# Altium schematic sheet Mother_board.SchDoc
size 594 x 420 mm; CheckedBy: Алексеев; Author: Нгуен; CompanyName: ПИСК, гр.912601; DrawnBy: Алексеев; Engineer: Алексеев; Address3: Т; Address4: коротковолновой радиостанций; DocumentNumber: ГУИР.467872.014-001 Э3; SheetNumber: 1; SheetTotal: 1; ImagePath: Евдокимова
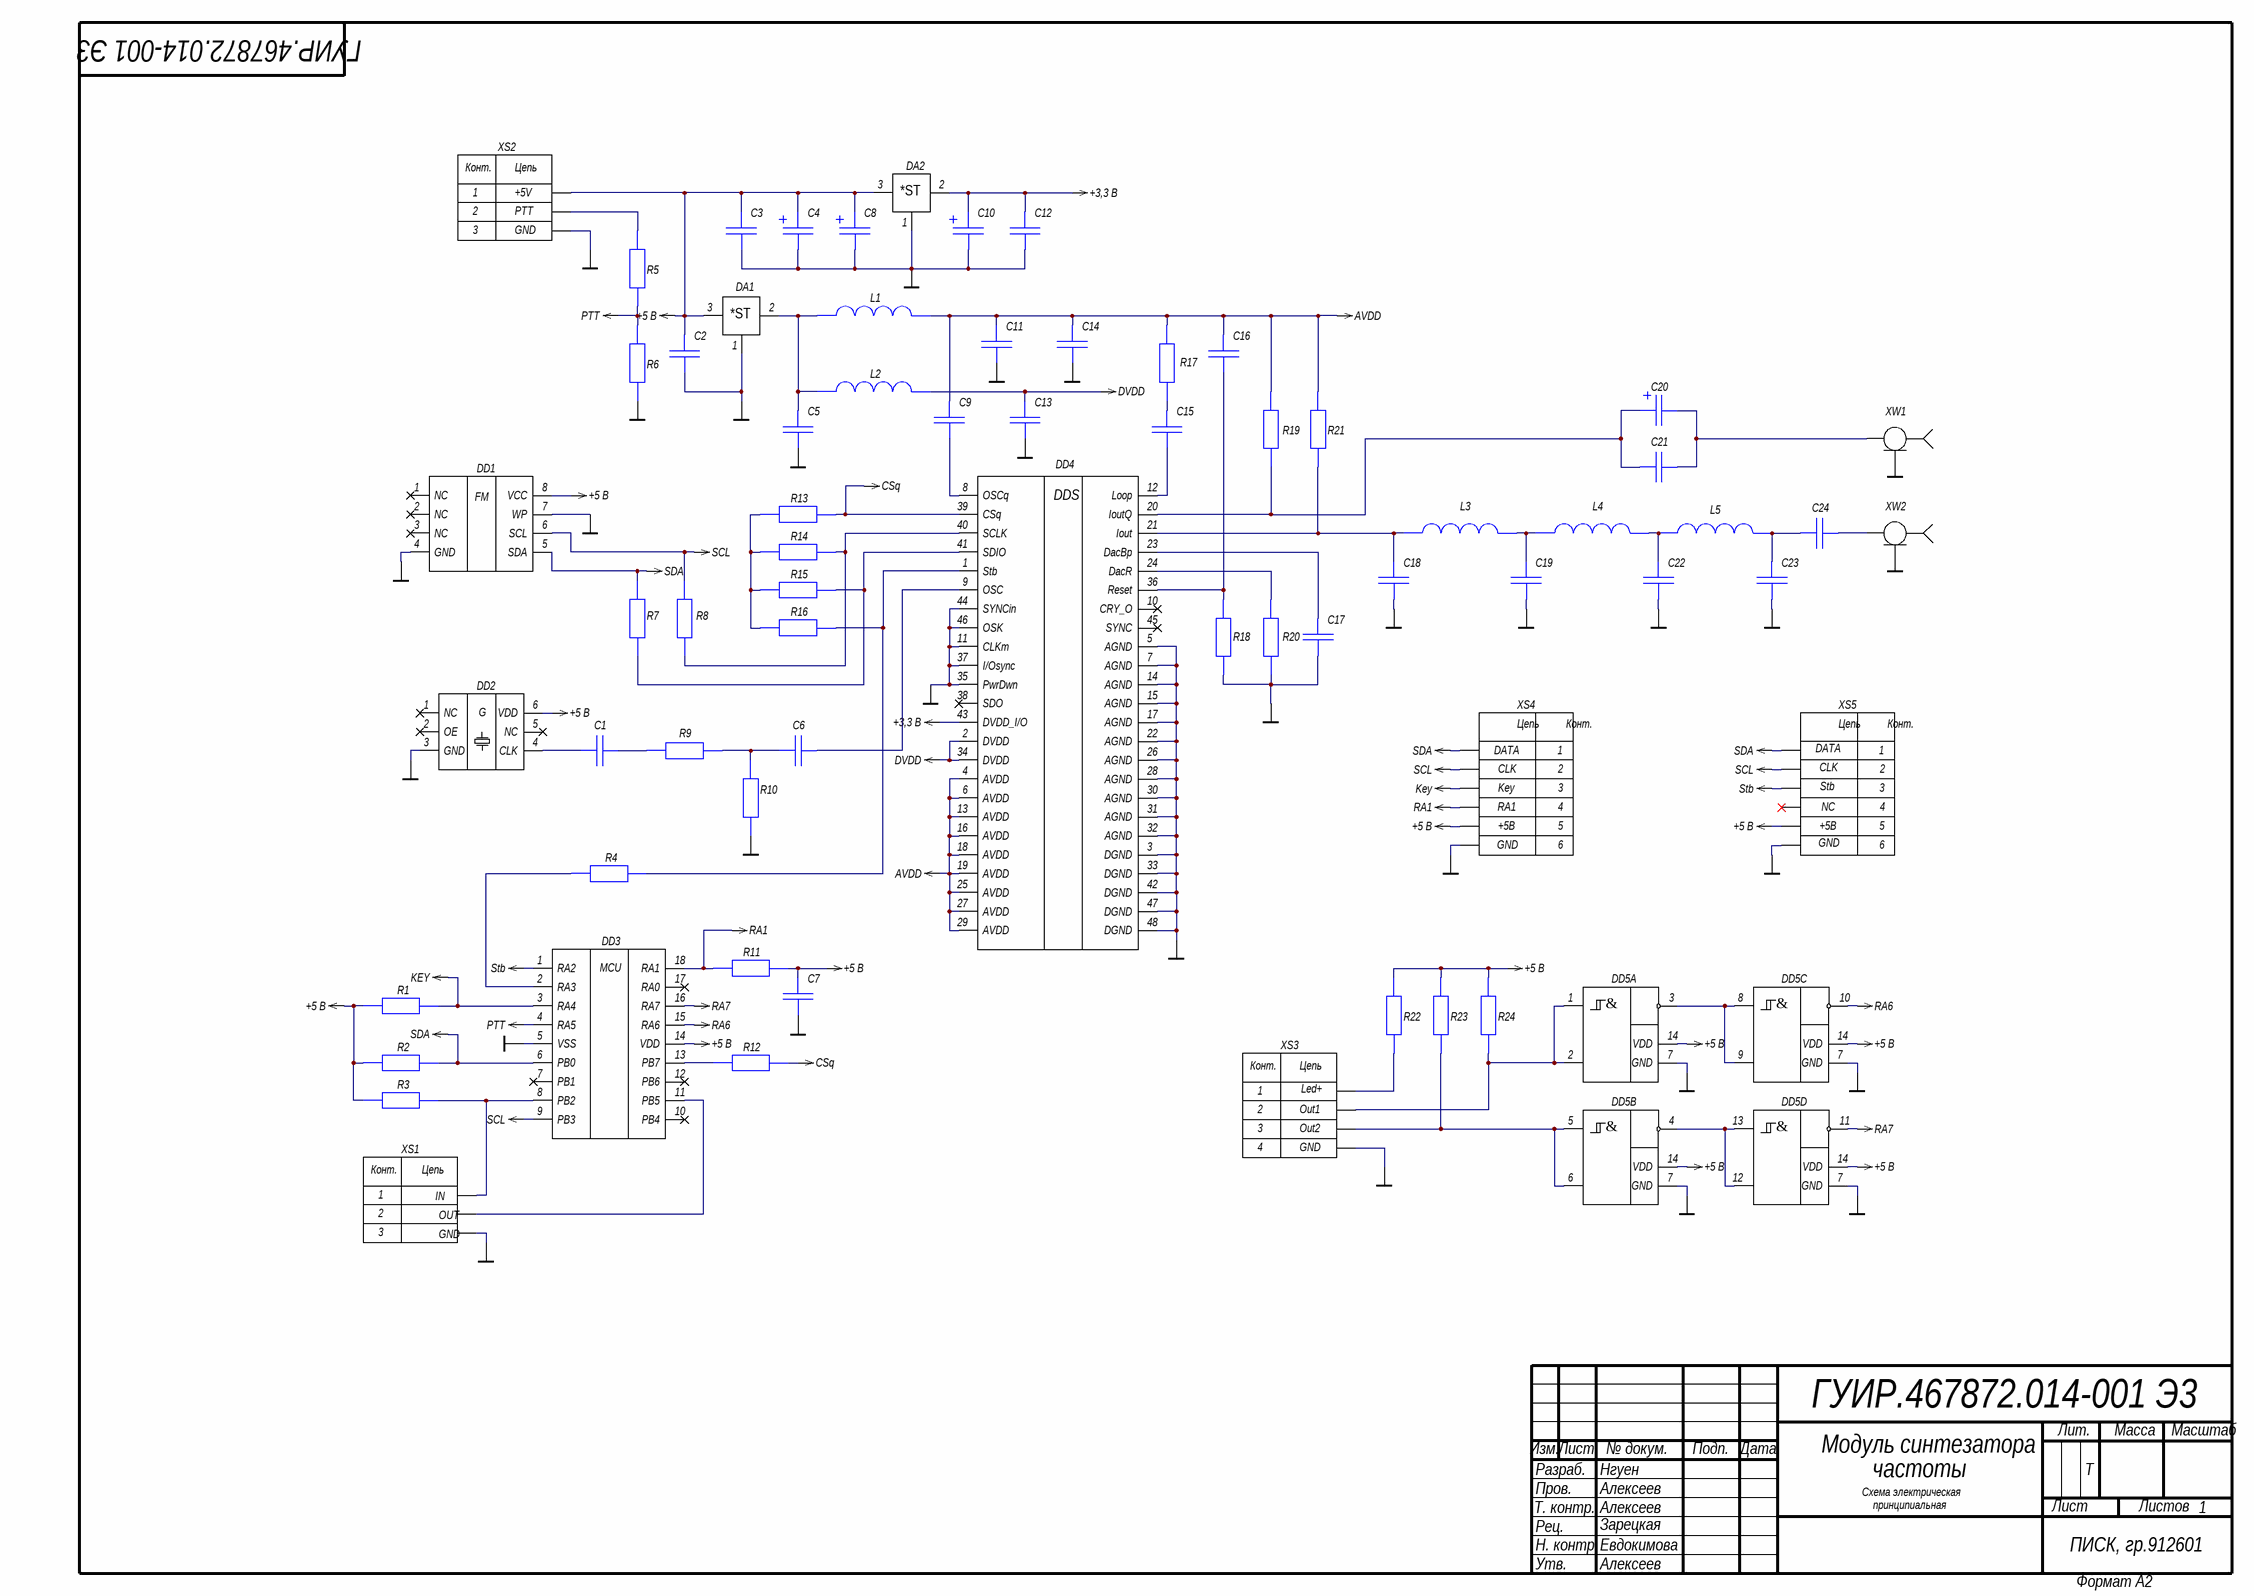
[diagram p0: Mother_board.SchDoc]

## Parts
C1  cap  [CAP_1206]  (value not drawn)
C2  cap  [CAP_1206]  (value not drawn)
C3  cap  [CAP_1206]  (value not drawn)
C4  cap_E  [EIA6032]  (value not drawn)
C5  cap  [CAP_1206]  (value not drawn)
C6  cap  [CAP_1206]  (value not drawn)
C7  cap  [CAP_1206]  (value not drawn)
C8  cap_E  [EIA3216]  (value not drawn)
C9  cap  [CAP_1206]  (value not drawn)
C10  cap_E  [EIA3216]  (value not drawn)
C11  cap  [CAP_1206]  (value not drawn)
C12  cap  [CAP_1206]  (value not drawn)
C13  cap  [CAP_1206]  (value not drawn)
C14  cap  [CAP_1206]  (value not drawn)
C15  cap  [CAP_1206]  (value not drawn)
C16  cap  [CAP_1206]  (value not drawn)
C17  cap  [CAP_1206]  (value not drawn)
C18  cap  [CAP_1206]  (value not drawn)
C19  cap  [CAP_1206]  (value not drawn)
C20  cap_E  [EIA3216]  (value not drawn)
C21  cap  [CAP_1206]  (value not drawn)
C22  cap  [CAP_1206]  (value not drawn)
C23  cap  [CAP_1206]  (value not drawn)
C24  cap  [CAP_1206]  (value not drawn)
DA1  Микросхем. стаб. напря.  [LD1117-3.3V]  (value not drawn)
DA2  Микросхем. стаб. напря.  [LD1117-3.3V]  (value not drawn)
DD1  FM24C16B  [FM24C16B]  (value not drawn)
DD2  ETXO-H33CL  [OSC_ETXO-H33CL-100.000]  (value not drawn)
DD3  PIC16F88P  [PIC16F88]  (value not drawn)
DD4  AD9951YSVZ  [AD9951YSVZ]  (value not drawn)
DD5  74HC132D  [74HC123D]  (value not drawn)  (parts A,B,C,D of 4)
L1  coil  [B82472G6103M000]  (value not drawn)
L2  coil  [B82472G6103M000]  (value not drawn)
L3  coil  [LQW2BHNR33K03L]  (value not drawn)
L4  coil  [LQW2BHNR33K03L]  (value not drawn)
L5  coil  [LQW2BHNR33K03L]  (value not drawn)
R1  res-0.125w  [res-0805-0.125]  (value not drawn)
R2  res-0.125w  [res-0805-0.125]  (value not drawn)
R3  res-0.125w  [res-0805-0.125]  (value not drawn)
R4  res-0.125w  [res-0805-0.125]  (value not drawn)
R5  res-0.125w  [res-0805-0.125]  (value not drawn)
R6  res-0.125w  [res-0805-0.125]  (value not drawn)
R7  res-0.125w  [res-0805-0.125]  (value not drawn)
R8  res-0.125w  [res-0805-0.125]  (value not drawn)
R9  res-0.125w  [res-0805-0.125]  (value not drawn)
R10  res-0.125w  [res-0805-0.125]  (value not drawn)
R11  res-0.125w  [res-0805-0.125]  (value not drawn)
R12  res-0.125w  [res-0805-0.125]  (value not drawn)
R13  res-0.125w  [res-0805-0.125]  (value not drawn)
R14  res-0.125w  [res-0805-0.125]  (value not drawn)
R15  res-0.125w  [res-0805-0.125]  (value not drawn)
R16  res-0.125w  [res-0805-0.125]  (value not drawn)
R17  res-0.125w  [res-0805-0.125]  (value not drawn)
R18  res-0.125w  [res-0805-0.125]  (value not drawn)
R19  res-0.125w  [res-0805-0.125]  (value not drawn)
R20  res-0.125w  [res-0805-0.125]  (value not drawn)
R21  res-0.125w  [res-0805-0.125]  (value not drawn)
R22  res-0.125w  [res-0805-0.125]  (value not drawn)
R23  res-0.125w  [res-0805-0.125]  (value not drawn)
R24  res-0.125w  [res-0805-0.125]  (value not drawn)
XS1  Разьем 3 кон  [ED555/3DS]  (value not drawn)
XS2  разьем источника  [ED555/3DS]  (value not drawn)
XS3  разьем VALKOD  [B4B-PH-K]  (value not drawn)
XS4  Разьем 6 кон.  [B6B-PH-K-S_LS_SN]  (value not drawn)
XS5  Разьем 6 кон.  [B6B-PH-K-S_LS_SN]  (value not drawn)
XW1  Коаксиальное  [HYR-1141]  (value not drawn)
XW2  Коаксиальное  [HYR-1141]  (value not drawn)

## Nets
+3,3 В: C10.1 C12.2 DA2.2 DD4.43(DVDD_I/O)
+5 В: C2.2 C3.2 C4.1 C7.1 C8.1 DA1.3 DA2.3 DD1.8(VCC) DD2.6(VDD) DD3.14(VDD) DD5.14(VDD) R1.2 R2.2 R3.2 R11.1 R22.2 R23.2 R24.2 XS2.1 XS4.5 XS5.5
AVDD: C9.2 C11.2 C14.2 C16.2 DD4.4(AVDD) DD4.6(AVDD) DD4.13(AVDD) DD4.16(AVDD) DD4.18(AVDD) DD4.19(AVDD) DD4.25(AVDD) DD4.27(AVDD) DD4.29(AVDD) L1.2 R17.2 R19.2 R21.2
CSq: DD4.39(CSq) R12.1 R13.1
DVDD: C13.2 DD4.2(DVDD) DD4.34(DVDD) L2.2
GND: C2.1 C3.1 C4.2 C5.1 C7.2 C8.2 C10.2 C11.1 C12.1 C13.1 C14.1 C17.2 C18.2 C19.2 C22.2 C23.2 DA1.1 DA2.1 DD1.4(GND) DD1.7(WP) DD2.3(GND) DD3.5(VSS) DD4.3(DGND) DD4.5(AGND) DD4.7(AGND) DD4.11(CLKm) DD4.14(AGND) DD4.15(AGND) DD4.17(AGND) DD4.22(AGND) DD4.26(AGND) DD4.28(AGND) DD4.30(AGND) DD4.31(AGND) DD4.32(AGND) DD4.33(DGND) DD4.35(PwrDwn) DD4.37(I/Osync) DD4.42(DGND) DD4.44(SYNCin) DD4.46(OSK) DD4.47(DGND) DD4.48(DGND) DD5.7(GND) R6.1 R10.2 R18.1 R20.1 XS1.3 XS2.3 XS3.4 XS4.6 XS5.6 XW1.2 XW2.2
Key: DD3.3(RA4) R1.1 XS4.3
PTT: DD3.4(RA5) R5.1 R6.2
RA1: DD3.18(RA1) R11.2 XS4.4
RA6: DD3.15(RA6) DD5.10
RA7: DD3.16(RA7) DD5.11
SCL: DD1.6(SCL) DD3.9(PB3) R8.2 XS4.2 XS5.2
SDA: DD1.5(SDA) DD3.6(PB0) R2.1 R7.2 XS4.1 XS5.1
Stb: DD3.1(RA2) XS5.3
NetC1_1: C1.1 DD2.4(CLK)
NetC1_2: C1.2 R9.2
NetC5_2: C5.2 DA1.2 L1.1 L2.1
NetC6_1: C6.1 R9.1 R10.1
NetC6_2: C6.2 DD4.9(OSC)
NetC9_1: C9.1 DD4.8(OSCq)
NetC15_1: C15.1 DD4.12(Loop)
NetC15_2: C15.2 R17.1
NetC16_1: C16.1 DD4.36(Reset) R18.2
NetC17_1: C17.1 DD4.23(DacBp)
NetC18_1: C18.1 DD4.21(Iout) L3.1 R21.1
NetC19_1: C19.1 L3.2 L4.1
NetC20_1: C20.1 C21.1 DD4.20(IoutQ) R19.1
NetC20_2: C20.2 C21.2 XW1.1
NetC22_1: C22.1 L4.2 L5.1
NetC23_1: C23.1 C24.1 L5.2
NetC24_2: C24.2 XW2.1
NetDD3_2: DD3.2(RA3) R4.1
NetDD3_8: DD3.8(PB2) R3.1 XS1.1
NetDD3_11: DD3.11(PB5) XS1.2
NetDD3_13: DD3.13(PB7) R12.2
NetDD4_1: DD4.1(Stb) R4.2 R16.1
NetDD4_24: DD4.24(DacR) R20.2
NetDD4_40: DD4.40(SCLK) R8.1 R14.1
NetDD4_41: DD4.41(SDIO) R7.1 R15.1
NetDD5_1: DD5.1 DD5.2 R24.1 XS3.2
NetDD5_3: DD5.3 DD5.8 DD5.9
NetDD5_4: DD5.4 DD5.12 DD5.13
NetDD5_5: DD5.5 DD5.6 R23.1 XS3.3
NetR5_2: R5.2 XS2.2
NetR13_2: R13.2 R14.2 R15.2 R16.2
NetR22_1: R22.1 XS3.1

Not connected (* = marked no-connect by the designer): DD1 1(NC)* 2(NC)* 3(NC)*; DD2 1(NC)* 2(OE)* 5(NC)*; DD3 7(PB1)* 10(PB4)* 12(PB6)* 17(RA0)*; DD4 10(CRY_O)* 38(SDO)* 45(SYNC)*; XS5 4*

## Notes on the sheet
- (near DA2) 1
- (near DA1) 1
- (near DD1) FM
- (near XS4) DATA
- (near XS4) CLK
- (near XS4) Key
- (near XS5) DATA
- (near XS5) CLK
- (near XS5) Stb
- (near XS4) RA1
- (near XS4) +5B
- (near XS5) +5B
- (near XS5) NC
- (near XS4) GND
- (near XS5) GND
- (near XS1) IN
- (near XS1) OUT
- (near XS1) GND
- Модуль синтезатора
- частоты
- Зарецкая
- Разраб.
- Изм.
- Лист
- № докум.
- Подп.
- Дата
- Лит.
- Масса
- Масштаб
- Т. контр.
- Пров.
- принципиальная
- Схема электрическая
- Листов
- Н. контр.
- Утв.
- Рец.
- Формат А2
- (in symbol 74HC132D, part A) &
- (in symbol 74HC132D, part B) &
- (in symbol 74HC132D, part C) &
- (in symbol 74HC132D, part D) &
- (in symbol AD9951YSVZ) DDS
- (in symbol ETXO-H33CL) G
- (in symbol PIC16F88P) MCU
- (in symbol Микросхем. стаб. напря.) *ST
- (in symbol Разьем 3 кон) Конт.; Цепь
- (in symbol Разьем 6 кон.) Цепь; Конт.
- (in symbol разьем VALKOD) Конт.; Цепь; Led+; Out1; Out2; GND
- (in symbol разьем источника) Конт.; Цепь; +5V; PTT; GND

## Library data of the parts
XS4 XS5 = Разьем 6 кон.: System: Connector